# EAGLE design BHONoff (EAGLE 8.3.2)
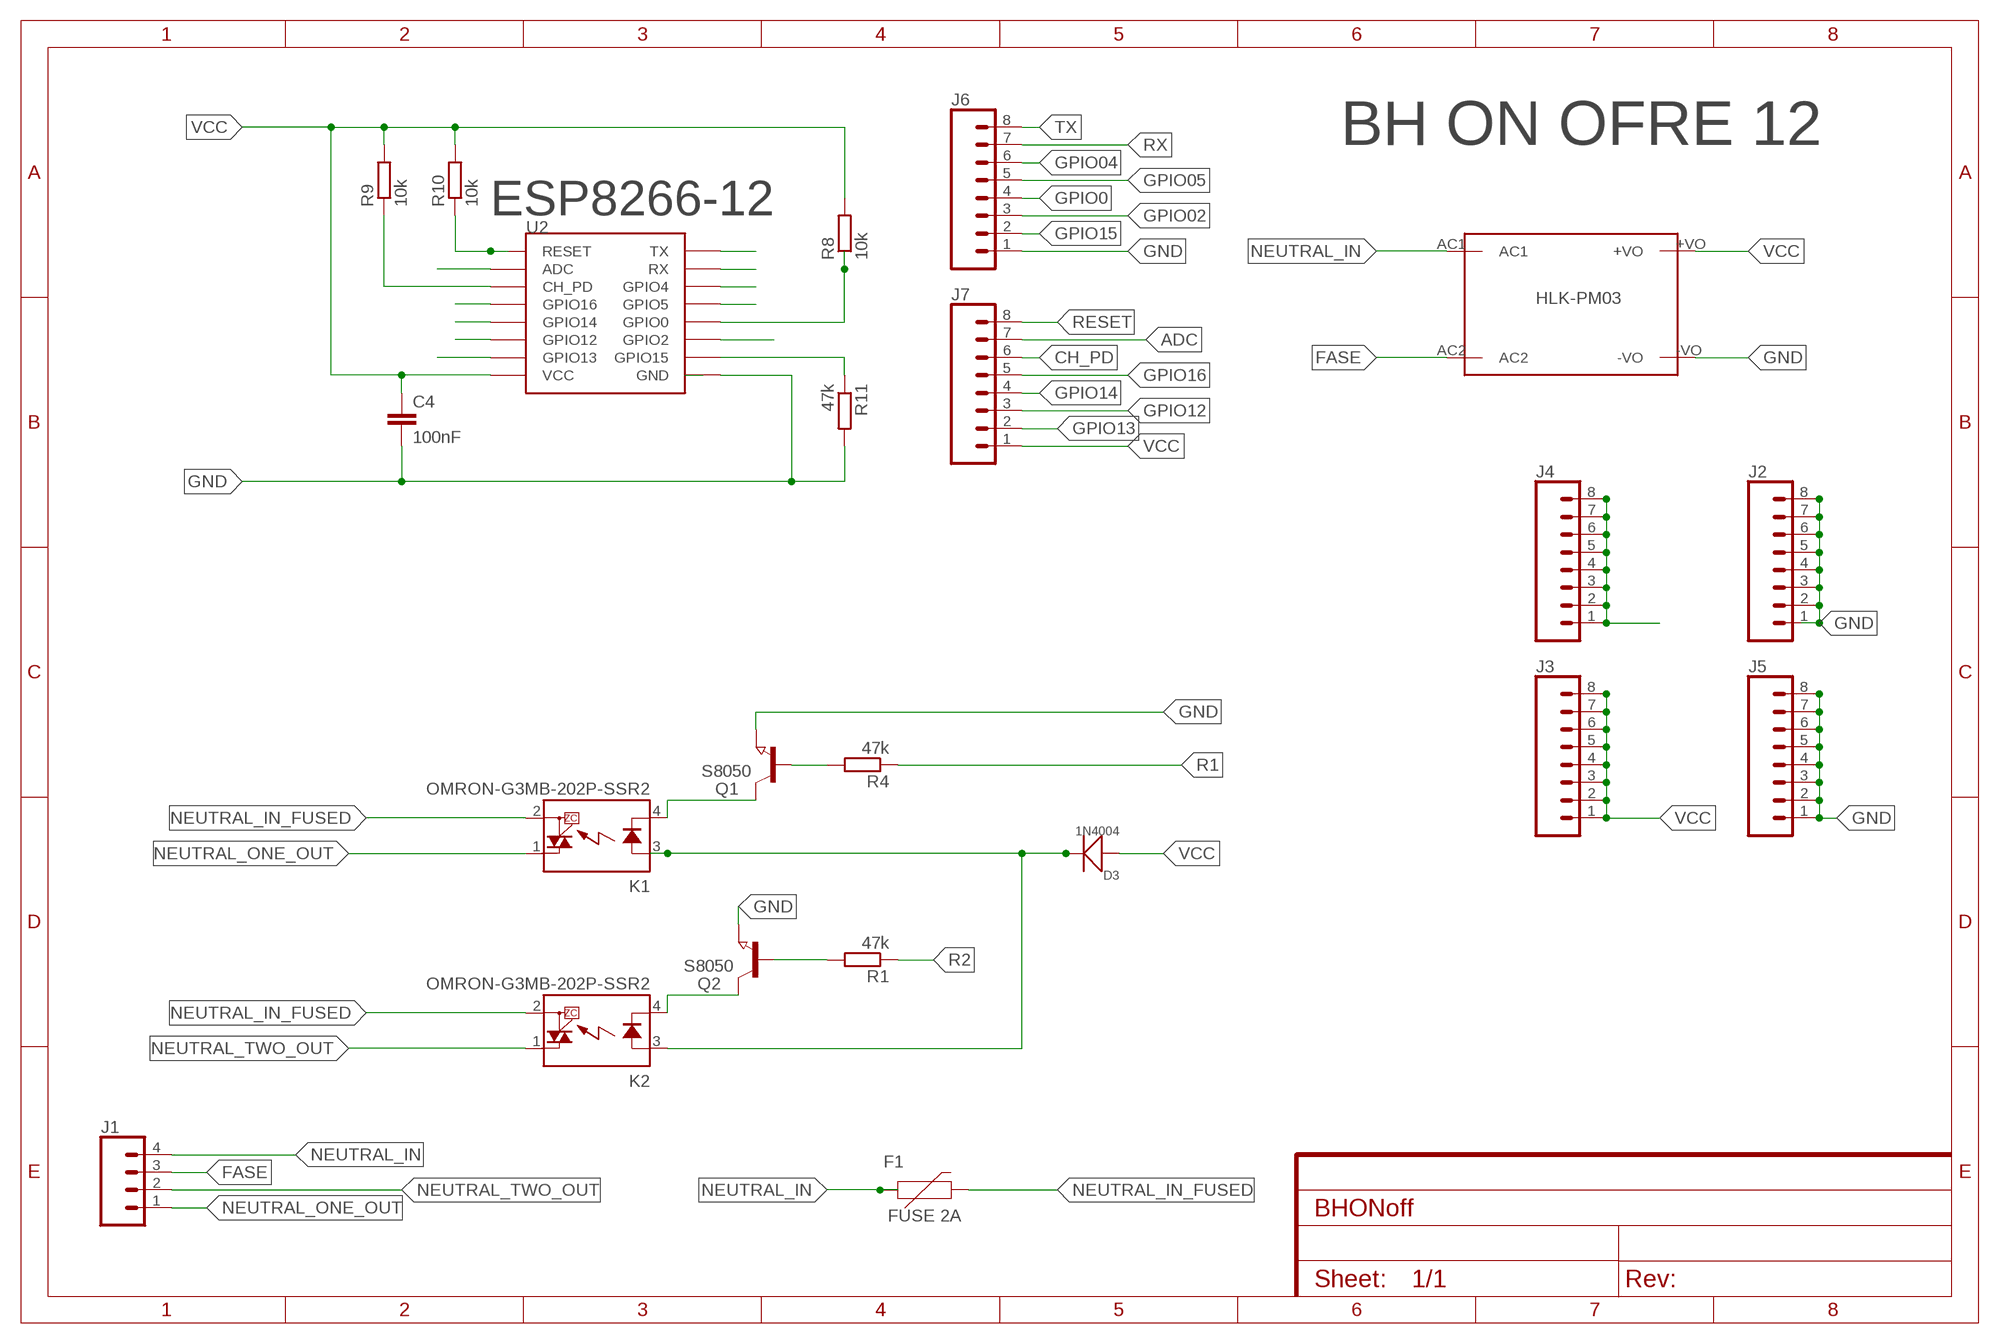
[diagram p0: schematic, sheet 1]

## Parts
C4  100nF  10NF-0603-50V-10%  [0603]
D3  1N4004  DIODE-GEN-PURPOSE-1KV-1A(DO-214AC)  [DO-214AC]
F1  FUSE 2A  PPTC_PTH  [PTH]
J1  CONN_04SCREW  [SCREWTERMINAL-3.5MM-4]
J2  CONN_08"  [1X08]
J3  CONN_08"  [1X08]
J4  CONN_08"  [1X08]
J5  CONN_08"  [1X08]
J6  CONN_08"  [1X08]
J7  CONN_08"  [1X08]
K1  OMRON-G3MB-202P-SSR2  [OMRON-G3MB-202P-SSR]
K2  OMRON-G3MB-202P-SSR2  [OMRON-G3MB-202P-SSR]
Q1  S8050  NPN-TRANSISTOR_SOT23  [SOT23]
Q2  S8050  NPN-TRANSISTOR_SOT23  [SOT23]
R1  47k  R-EU_R0603  [R0603]
R4  47k  R-EU_R0603  [R0603]
R8  10k  R-EU_R0603  [R0603]
R9  10k  R-EU_R0603  [R0603]
R10  10k  R-EU_R0603  [R0603]
R11  47k  R-EU_R0603  [R0603]
U2  ESP12SMD  [ESP12-SMD]
U$2  HLK-PM03  [HLK-PM03]

## Nets
ADC: J7.7 U2.ADC
CH_PD: J7.6 R9.1 U2.CH_PD
FASE: J1.3 U$2.AC2
GND: C4.2 J2.1 J2.2 J2.3 J2.4 J2.5 J2.6 J2.7 J2.8 J5.1 J5.2 J5.3 J5.4 J5.5 J5.6 J5.7 J5.8 J6.1 Q1.2(E) Q2.2(E) R11.2 U2.GND U$2.-VO
GPIO0: J6.4 R8.1 U2.GPIO0
GPIO02: J6.3 U2.GPIO2
GPIO04: J6.6 U2.GPIO4
GPIO05: J6.5 U2.GPIO5
GPIO12: J7.3 U2.GPIO12
GPIO13: J7.2 U2.GPIO13
GPIO14: J7.4 U2.GPIO14
GPIO15: J6.2 R11.1 U2.GPIO15
GPIO16: J7.5 U2.GPIO16
N$1: K1.4(K) Q1.3(C)
N$2: D3.2(-) K1.3(A) K2.3(A)
N$7: Q1.1(B) R4.2
N$9: K2.4(K) Q2.3(C)
N$13: Q2.1(B) R1.2
NEUTRAL_IN: F1.P$1 J1.4 U$2.AC1
NEUTRAL_IN_FUSED: F1.P$2 K1.2(DS2) K2.2(DS2)
NEUTRAL_ONE_OUT: J1.1 K1.1(DS1)
NEUTRAL_TWO_OUT: J1.2 K2.1(DS1)
R1: R4.1
R2: R1.1
RESET: J7.8 R10.1 U2.RESET
RX: J6.7 U2.RXD0(RX)
TX: J6.8 U2.TXD0(TX)
VCC: C4.1 D3.1(+) J3.1 J3.2 J3.3 J3.4 J3.5 J3.6 J3.7 J3.8 J4.1 J4.2 J4.3 J4.4 J4.5 J4.6 J4.7 J4.8 J7.1 R8.2 R9.2 R10.2 U2.VCC U$2.+VO

## Notes on the sheet
- BH ON OFRE 12
- ESP8266-12
- HLK-PM03

## Library data of the parts
C4 = SparkFun-Capacitors:10NF: 0.01uF/10nF/10,000pF ceramic capacitors A capacitor is a passive two-terminal electrical component used to store electrical energy temporarily in an electric field. CAP-09321; PROD_ID: CAP-00867; VALUE: 10nF
D3 = Seeed-Diode:DIODE-GEN-PURPOSE-1KV-1A(DO-214AC): 304010013; MPN: 1N4007; VALUE: 1N4007
F1 = SparkFun-Fuses:PPTC: Resettable Fuse PPTC Resettable Fuse. Really a sort of resistor with a polymeric positive temperature coefficient whose resistance increases dramatically with an increase in temperature. When heated by the power passing through the resistance rises causing the current to be limited, protecting the circuit. This is achieved by the transition of the polymer from a crystalline to an amorphous state where the conductive carbon separates breaking the conductive pathways found in the cool crystalline structure. When a PPTC cools back down it resumes conducting letting the circuit turn back on. SparkFun Products: SparkFun RedBoard - Programmed with Arduino <https://www.sparkfun.com/products/12757> Pro Micro - 5V/16MHz <https://www.sparkfun.com/products/12640> Arduino Pro 328 - 5V/16MHz <https://www.sparkfun.com/products/10915> MP3 Trigger <https://www.sparkfun.com/products/13720>; PROD_ID: RES-08490; VALUE: 72V/0.25A
J1 = SparkFun-Connectors:CONN_04: Multi connection point. Often used as Generic Header-pin footprint for 0.1 inch spaced/style header connections On any of the 0.1 inch spaced packages, you can populate with these: Break Away Headers - Straight <https://www.sparkfun.com/products/116> (PRT-00116) Break Away Male Headers - Right Angle <https://www.sparkfun.com/products/553> (PRT-00553) Female Headers <https://www.sparkfun.com/products/115> (PRT-00115) Break Away Headers - Machine Pin <https://www.sparkfun.com/products/117> (PRT-00117) Break Away Female Headers - Swiss Machine Pin <https://www.sparkfun.com/products/743> (PRT-00743) For SCREWTERMINALS and SPRING TERMINALS visit here: Screw Terimnals on SparkFun.com <https://www.sparkfun.com/search/results?term=Screw+Terminals> (5mm/3.5mm/2.54mm spacing) This device is also useful as a general connection point to wire up your design to another part of your project. Our various solder wires solder well into these plated through hole pads. Hook-Up Wire - Assortment (Stranded, 22 AWG) <https://www.sparkfun.com/products/11375> (PRT-11375) Hook-Up Wire - Assortment (Solid Core, 22 AWG) <https://www.sparkfun.com/products/11367> (PRT-11367) View the entire wire category on our website here <https://www.sparkfun.com/categories/141> Special notes: Molex polarized connector foot print use with SKU : PRT-08231 with associated crimp pins and housings. 1MM SMD Version SKU: PRT-10208; PROD_ID: 2xCONN-08399; SF_ID: 2xPRT-08084
J2-J7 = SparkFun-Connectors:CONN_08: Multi connection point. Often used as Generic Header-pin footprint for 0.1 inch spaced/style header connections On any of the 0.1 inch spaced packages, you can populate with these: Break Away Headers - Straight <https://www.sparkfun.com/products/116> (PRT-00116) Break Away Male Headers - Right Angle <https://www.sparkfun.com/products/553> (PRT-00553) Female Headers <https://www.sparkfun.com/products/115> (PRT-00115) Break Away Headers - Machine Pin <https://www.sparkfun.com/products/117> (PRT-00117) Break Away Female Headers - Swiss Machine Pin <https://www.sparkfun.com/products/743> (PRT-00743) Arduino Stackable Header - 8 Pin <https://www.sparkfun.com/products/9279> (PRT-09279) For SCREWTERMINALS and SPRING TERMINALS visit here: Screw Terimnals on SparkFun.com <https://www.sparkfun.com/search/results?term=Screw+Terminals> (5mm/3.5mm/2.54mm spacing) This device is also useful as a general connection point to wire up your design to another part of your project. Our various solder wires solder well into these plated through hole pads. Hook-Up Wire - Assortment (Stranded, 22 AWG) <https://www.sparkfun.com/products/11375> (PRT-11375) Hook-Up Wire - Assortment (Solid Core, 22 AWG) <https://www.sparkfun.com/products/11367> (PRT-11367) View the entire wire category on our website here <https://www.sparkfun.com/categories/141> Special notes: Molex polarized connector foot print use with SKU : PRT-08231 with associated crimp pins and housings. 1MM SMD Version SKU: PRT-10208 NOTES ON THE VARIANTS LOCK and LOCK_LONGPADS... This footprint was designed to help hold the alignment of a through-hole component (i.e. 6-pin header) while soldering it into place. You may notice that each hole has been shifted either up or down by 0.005 of an inch from it's more standard position (which is a perfectly straight line). This slight alteration caused the pins (the squares in the middle) to touch the edges of the holes. Because they are alternating, it causes a "brace" to hold the component in place. 0.005 has proven to be the perfect amount of "off-center" position when using our standard breakaway headers. Although looks a little odd when you look at the bare footprint, once you have a header in there, the alteration is very hard to notice. Also,if you push a header all the way into place, it is covered up entirely on the bottom side.; PROD_ID: CONN-08438
K1 K2 = Omron G3MB 202p SSR:OMRON-G3MB-202P-SSR: IT(rms) 8A, Zero Cross type SIP 4pin Triac output SSR Source: http://sharp-world.com/products/device/lineup/data/pdf/datasheet/s102s02_e.pdf; MPN: S202S02F; OC_FARNELL: 1618475; OC_NEWARK: 14N9588
Q1 Q2 = semicon-smd-ipc:NPN-TRANSISTOR_: NPN TRANSISTOR
R1 R4 R8-R11 = resistor:R-EU_: RESISTOR, European symbol
U2 = esp8266modules:ESP12: ESP8266 Wifi module 12
U$2 = PowerSocket:HLK-PM03

## Net classes
1 220V: clearance 2.54 mm

## Board
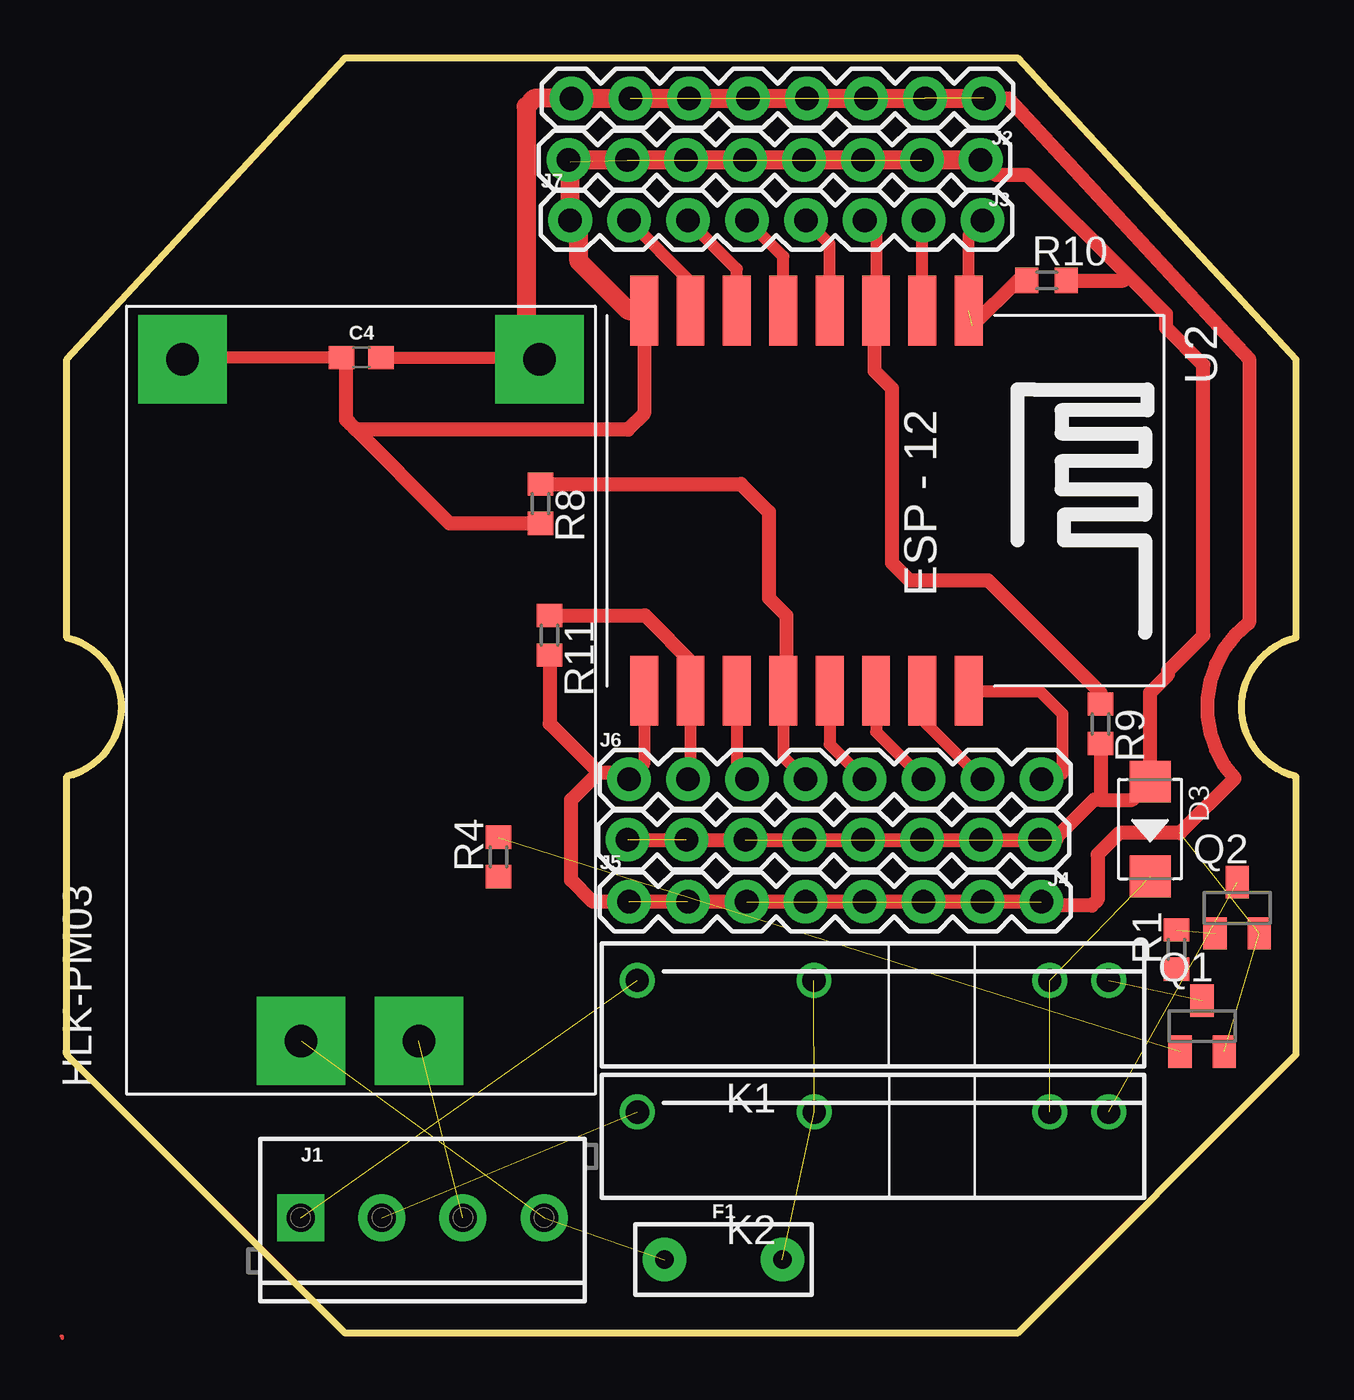
[diagram p1: board, top side]

Size 53 x 55 mm. Coordinates in mm from the lower left corner, seen from the top.
Outline: 53,12 41,0 12,0 0,12 0,24 arc152 0,30 0,42 12,55 41,55 53,42 53,30 arc152 53,24 53,12
Copper layers (1*16): Top 0.035mm / dielectric 1.5mm / Bottom 0.035mm
Design rules "default": minimum track width 6mil, minimum drill 0.35mm, track to track 6mil, track to pad 6mil, pad to pad 6mil, via to via 6mil, smd to smd 6mil, copper to edge 40mil, drill to drill 6mil, minimum pad ring 10mil, minimum via ring 8mil, stop-mask expansion 4mil, vias tented up to drill 0mil, thermal gap 10mil

### Footprints (pad centres in the part's own frame; a part is rotated, then mirrored left to right if it is on the bottom)
0603 = smd 1.1 x 1: 1 -0.85,0; 2 0.85,0
DO-214AC = smd 1.8 x 1.77: 1 -2.042,0; 2 2.042,0
PTH = drill 0.8 pad 1.88: P$1 -2.54,0; P$2 2.54,0
SCREWTERMINAL-3.5MM-4 = drill 1.2 pad 2.032 square: 1 0,0 | drill 1.2 pad 2.032: 2 3.5,0; 3 7,0; 4 10.5,0
1X08 = drill 1.016 pad 1.88: 1 0,0; 2 2.54,0; 3 5.08,0; 4 7.62,0; 5 10.16,0; 6 12.7,0; 7 15.24,0; 8 17.78,0
OMRON-G3MB-202P-SSR = drill 1: 1 -12.7,0; 2 -5.08,0; 3 5.08,0; 4 7.62,0
SOT23 = smd 1 x 1.4: 1 -0.95,-1.1; 2 0.95,-1.1; 3 0,1.1
R0603 = smd 1 x 1.1: 1 -0.85,0; 2 0.85,0
ESP12-SMD = smd 3 x 1.2: ADC -8.3,3.8; CH_PD -8.3,1.8; GND 8.1,-8.2; GPIO0 8.1,-2.2; GPIO2 8.1,-4.2; GPIO4 8.1,1.8; GPIO5 8.1,-0.2; GPIO12 -8.3,-4.2; GPIO13 -8.3,-6.2; GPIO14 -8.3,-2.2; GPIO15 8.1,-6.2; GPIO16 -8.3,-0.2; RESET -8.3,5.8; RXD0 8.1,3.8; TXD0 8.1,5.8; VCC -8.3,-8.2
HLK-PM03 = drill 1.4 pad 3.81 square: +VO 29.4,10.2; -VO 29.4,-5.2; AC1 0,5.08; AC2 0,0

### Placement (x,y rotation side)
C4  12.7,42.08 0 top
D3  46.71,21.73 270 top
F1  28.32,3.17 0 top
J1  10.08,4.97 0 top
J2  39.54,53.26 180 top
J3  39.41,50.6 180 top
J4  41.96,21.27 180 top
J5  24.24,18.6 0 top
J6  24.24,23.88 0 top
J7  21.71,48 0 top
K1  37.3,15.21 0 top
K2  37.3,9.53 0 top
Q1  48.95,13.24 0 top
Q2  50.46,18.34 0 top
R1  47.85,16.54 90 top
R4  18.61,20.54 90 top
R8  20.43,35.77 270 top
R9  44.57,26.28 270 top
R10  42.25,45.4 0 top
R11  20.82,30.1 270 top
U2  33.09,35.8 270 top
U$2  15.18,12.6 90 top

### Tracks (layer width: path | path; a pad name or v marks a point on that pad's centre or on a via)
ADC
  Top 0.508: U2.ADC 36.89,47.95 J7.7
CH_PD
  Top 0.508: U2.CH_PD 34.89,47.51 J7.6
  Top 0.61: R9.1 44.57,27.61 39.72,32.46 36.35,32.46 35.59,33.22 35.59,40.74 34.83,41.5 34.83,43.83 35,44
  Top 0.813: 35,44 U2.CH_PD
FASE  (1 unrouted)
GND  (14 unrouted)
  Top 0.508: U2.GND 24.89,24.53 24.41,24.05 J6.1 | C4.2 20.83,42.08 20.9,42.01 20.39,42.01 U$2.-VO
  Top 0.61: J2.1 40.61,53.26 50.99,42.01 50.99,30.65 50.94,30.62 50.38,30.11 49.92,29.51 49.56,28.84 49.31,28.13 49.18,27.38 49.18,26.62 49.31,25.87 49.56,25.16 49.92,24.49 50.36,23.93 47.99,21.56 45.38,21.56 44.45,20.64 44.45,18.69 44.2,18.44 42.18,18.44 J5.8 J5.1 22.68,18.6 21.75,19.54 21.75,23 22.93,24.18 | 22.93,24.18 24.28,24.18 24.41,24.05 | R11.2 20.82,26.29 22.93,24.18
  Top 0.813: J2.1 J2.8 20.16,53.26 19.81,52.9 19.81,42.58 U$2.-VO
GPIO0
  Top 0.508: U2.GPIO0 30.89,24.85 J6.4
  Top 0.61: R8.1 29.07,36.62 30.27,35.42 30.27,31.7 31.03,30.94 31.03,27.84 U2.GPIO0
GPIO02
  Top 0.508: U2.GPIO2 28.89,24.31 J6.3
GPIO04
  Top 0.508: U2.GPIO4 34.89,25.93 J6.6
GPIO05
  Top 0.508: U2.GPIO5 32.89,25.39 J6.5
GPIO12
  Top 0.508: U2.GPIO12 28.89,45.89 J7.3
GPIO13
  Top 0.508: U2.GPIO13 26.89,45.35 J7.2
GPIO14
  Top 0.508: U2.GPIO14 30.89,46.43 J7.4
GPIO15
  Top 0.508: U2.GPIO15 26.89,23.99 J6.2
  Top 0.61: R11.1 24.93,30.95 27.04,28.84 27.04,27.85 U2.GPIO15
GPIO16
  Top 0.508: U2.GPIO16 32.89,46.97 J7.5
N$1  (1 unrouted)
N$2  (2 unrouted)
N$4
  Top 0.15: -0.23,-0.15 -0.19,-0.15 -0.19,-0.22
N$7  (1 unrouted)
N$9  (1 unrouted)
N$13  (1 unrouted)
NEUTRAL_IN  (2 unrouted)
NEUTRAL_IN_FUSED  (2 unrouted)
NEUTRAL_ONE_OUT  (1 unrouted)
NEUTRAL_TWO_OUT  (1 unrouted)
RESET  (1 unrouted)
  Top 0.508: U2.RESET 38.89,47.41 J7.8
  Top 0.61: R10.1 41.01,45.4 39.05,43.44
RX
  Top 0.508: U2.RXD0 36.89,26.47 J6.7
TX
  Top 0.508: U2.TXD0 41.95,27.7 42.93,26.72 42.93,24.12 J6.8
VCC  (13 unrouted)
  Top 0.508: C4.1 5.06,42.08 U$2.+VO
  Top 0.61: J4.8 42.64,21.27 42.68,21.31 42.68,21.4 44.28,23 44.53,23 | 44.53,23 45.94,23 D3.1 46.71,27.63 47.49,28.41 47.49,28.58 49.01,30.1 49.01,41.75 47.4,43.36 47.4,43.96 45.76,45.6 | 45.76,45.6 41.41,49.95 40.06,49.95 J3.1 | U2.VCC 24.89,39.66 24.2,38.97 12.47,38.97 12.21,39.22 | 12.21,39.22 12.04,39.39 12.04,41.89 C4.1 | R10.2 45.56,45.4 45.76,45.6 | R9.2 44.57,23.04 44.53,23 | R8.2 16.51,34.92 12.21,39.22
  Top 0.813: U2.VCC 24.22,44.1 22.09,46.23 22.09,47.62 J7.1 21.71,50.52 J3.8 J3.1